# Altium project STM32_Project.PrjPcb
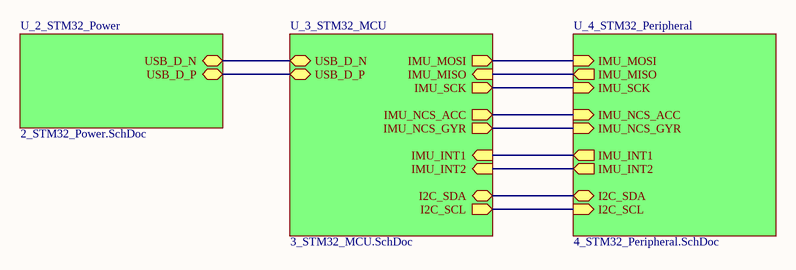
[diagram p0: 1_STM32_Overview.SchDoc]
4 sheets, 30 parts. Net scope: hierarchical (ports join the sheet entries above them; power ports are global).
Board file: STM32_PCB.PcbDoc
Sheets:
  1_STM32_Overview.SchDoc
    U_2_STM32_Power = 2_STM32_Power.SchDoc
    U_3_STM32_MCU = 3_STM32_MCU.SchDoc
    U_4_STM32_Peripheral = 4_STM32_Peripheral.SchDoc

## Sheet 1_STM32_Overview.SchDoc
size A; SheetNumber: 1; SheetTotal: 4

### Sub-sheets
U_2_STM32_Power = 2_STM32_Power.SchDoc: USB_D_N (bidir), USB_D_P (bidir)
U_3_STM32_MCU = 3_STM32_MCU.SchDoc: USB_D_N (bidir), USB_D_P (bidir), IMU_NCS_ACC (out), IMU_NCS_GYR (out), IMU_SCK (out), IMU_MISO (in), IMU_MOSI (out), I2C_SCL (out), I2C_SDA (bidir), IMU_INT1 (in), IMU_INT2 (in)
U_4_STM32_Peripheral = 4_STM32_Peripheral.SchDoc: IMU_SCK (in), IMU_MOSI (in), IMU_MISO (out), IMU_NCS_ACC (in), IMU_NCS_GYR (in), IMU_INT1 (out), IMU_INT2 (out), I2C_SCL (in), I2C_SDA (bidir)

### Nets
I2C_SCL: sheet U_3_STM32_MCU/I2C_SCL, sheet U_4_STM32_Peripheral/I2C_SCL
I2C_SDA: sheet U_3_STM32_MCU/I2C_SDA, sheet U_4_STM32_Peripheral/I2C_SDA
IMU_INT1: sheet U_3_STM32_MCU/IMU_INT1, sheet U_4_STM32_Peripheral/IMU_INT1
IMU_INT2: sheet U_3_STM32_MCU/IMU_INT2, sheet U_4_STM32_Peripheral/IMU_INT2
IMU_MISO: sheet U_3_STM32_MCU/IMU_MISO, sheet U_4_STM32_Peripheral/IMU_MISO
IMU_MOSI: sheet U_3_STM32_MCU/IMU_MOSI, sheet U_4_STM32_Peripheral/IMU_MOSI
IMU_NCC_ACC: sheet U_3_STM32_MCU/IMU_NCS_ACC, sheet U_4_STM32_Peripheral/IMU_NCS_ACC
IMU_NCC_GYR: sheet U_3_STM32_MCU/IMU_NCS_GYR, sheet U_4_STM32_Peripheral/IMU_NCS_GYR
IMU_SCK: sheet U_3_STM32_MCU/IMU_SCK, sheet U_4_STM32_Peripheral/IMU_SCK
USB_D_N: sheet U_2_STM32_Power/USB_D_N, sheet U_3_STM32_MCU/USB_D_N
USB_D_P: sheet U_2_STM32_Power/USB_D_P, sheet U_3_STM32_MCU/USB_D_P

## Sheet 2_STM32_Power.SchDoc
size A; SheetNumber: 2; SheetTotal: 4
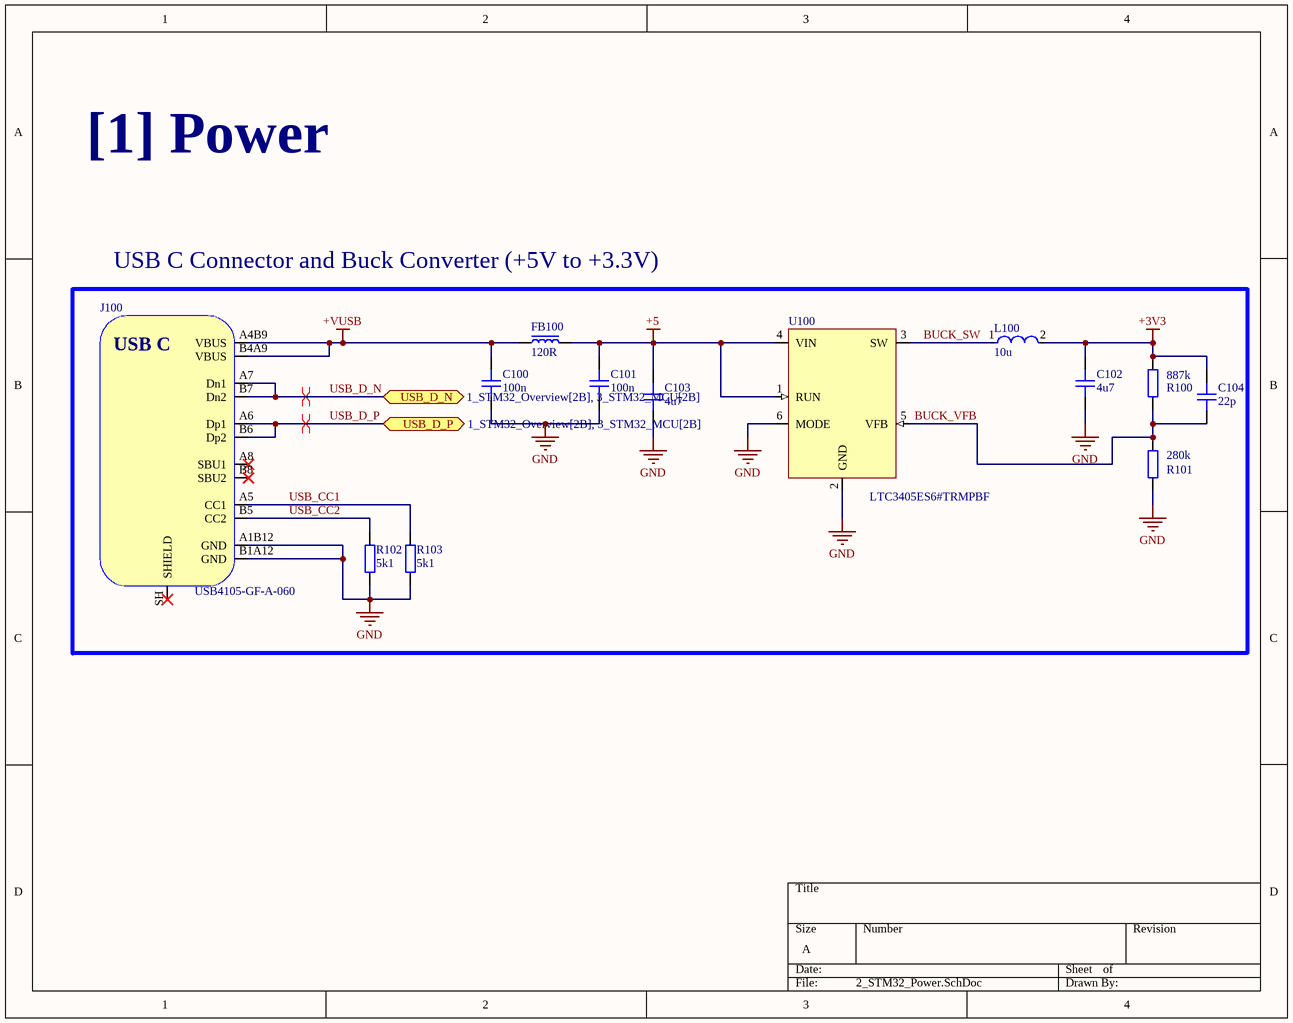
[diagram p1: 2_STM32_Power.SchDoc]

### Parts
C100  100n  [CAP_0603]
C101  100n  [CAP_0603]
C102  4u7  [CAP_0603]
C103  4u7  [CAP_0603]
C104  22p  [CAP_0603]
FB100  120R  [FB_0603]
J100  USB4105-GF-A-060  [USB4105-GF-A-060]
L100  10u  [FP-NRH2412-MFG]
R100  887k  [RES_0603]
R101  280k  [RES_0603]
R102  5k1  [RES_0603]
R103  5k1  [RES_0603]
U100  LTC3405ES6#TRMPBF  [SOT-23-6]

### Blocks framed on the sheet
USB C Connector and Buck Converter (+5V to +3.3V): C100-C104 FB100 J100 L100 R100-R103 U100

### Ports
USB_D_N (bidir, see 1_STM32_Overview[2B], 3_STM32_MCU[2B]), USB_D_P (bidir, see 1_STM32_Overview[2B], 3_STM32_MCU[2B])

### Nets
+3V3: C102.2 C104.2 L100.2 R100.2
+5: C101.2 C103.2 FB100.2 U100.1(RUN) U100.4(VIN)
+VUSB: C100.2 FB100.1 J100.A4B9(VBUS) J100.B4A9(VBUS)
GND: C100.1 C101.1 C102.1 C103.1 J100.A1B12(GND) J100.B1A12(GND) R101.1 R102.1 R103.1 U100.2(GND) U100.6(MODE)
BUCK_SW: L100.1 U100.3(SW)
BUCK_VFB: C104.1 R100.1 R101.2 U100.5(VFB)
USB_CC1: J100.A5(CC1) R103.2
USB_CC2: J100.B5(CC2) R102.2
USB_D_N: J100.A7(Dn1) J100.B7(Dn2) ; port USB_D_N
USB_D_P: J100.A6(Dp1) J100.B6(Dp2) ; port USB_D_P

Not connected (* = marked no-connect by the designer): J100 A8(SBU1)* B8(SBU2)* SH(SHIELD)*

### Layout directives
differential pair; differential pair class USB: USB_D_N, USB_D_P

### Notes on the sheet
- [1] Power
- (in symbol USB4105-GF-A-060) USB C

### Library data of the parts
C100-C104 = CAP_0603: Capacitor SMD 0603; Manufacturer: *; Manufacturer Part Number: *; Distributor Link: *; LCSC: *; Rating: *; Dielectric: *
FB100 = FB_0603: Ferrite Bead SMD 0603; Manufacturer: *; Manufacturer Part Number: *; Distributor Link: *; LCSC: *
J100 = USB4105-GF-A-060: USB Connector Type C SMT 12 Pin; Manufacturer: GCT; Manufacturer Part Number: USB4105-GF-A-060; Distributor Link: https://eu.mouser.com/ProductDetail/GCT/USB4105-GF-A-060?qs=QNEnbhJQKvY2mocwNJzgfA%3D%3D
L100 = CMP-14484-000582-1: Shielded Wirewound Inductor 10uH 20% 0.51A 0.72Ω SMD; DC Resistance (DCR): 600mR; Current Rating: 450mA; Saturation Current: 810mA; Core Material: Ferrite; Test Frequency: 100kHz; Self Resonant Frequency: 29MHz; Termination: SMD/SMT; Shielding: Shielded; Height - Seated (Max): 0.047inch; Case/Package: Nonstandard; Tolerance: 20%; Height: 1.2mm; Package Quantity: 2500; Mount: Surface Mount; Min Operating Temperature: -25°C; Inductance: 10uH; Width: 0.095inch; Length: 0.095inch; RoHS Compliant: Yes; Max DC Current: 810mA; Packaging: Tape and Reel; Max Operating Temperature: 120°C; Halogen Free: Halogen Free
R100 R101 = CMP-009-00183-1: Resistor SMD 0603; Manufacturer Part Number: *; Distributor Link: *; LCSC: *; Source: Schematic-Lib-PhilsLab.SchLib; Manufacturer: *; Design Item ID: RES_0603
R102 R103 = RES_0603: Resistor SMD 0603; Manufacturer: *; Manufacturer Part Number: *; Distributor Link: *; LCSC: *
U100 = LTC3405ES6#TRMPBF: 1.5MHz, 300mA / Synchronous Step-Down / Regulator in ThinSOT; Manufacturer: Analog Devices; Manufacturer Part Number: LTC3405ES6#TRMPBF

## Sheet 3_STM32_MCU.SchDoc
size A; SheetNumber: 3; SheetTotal: 4
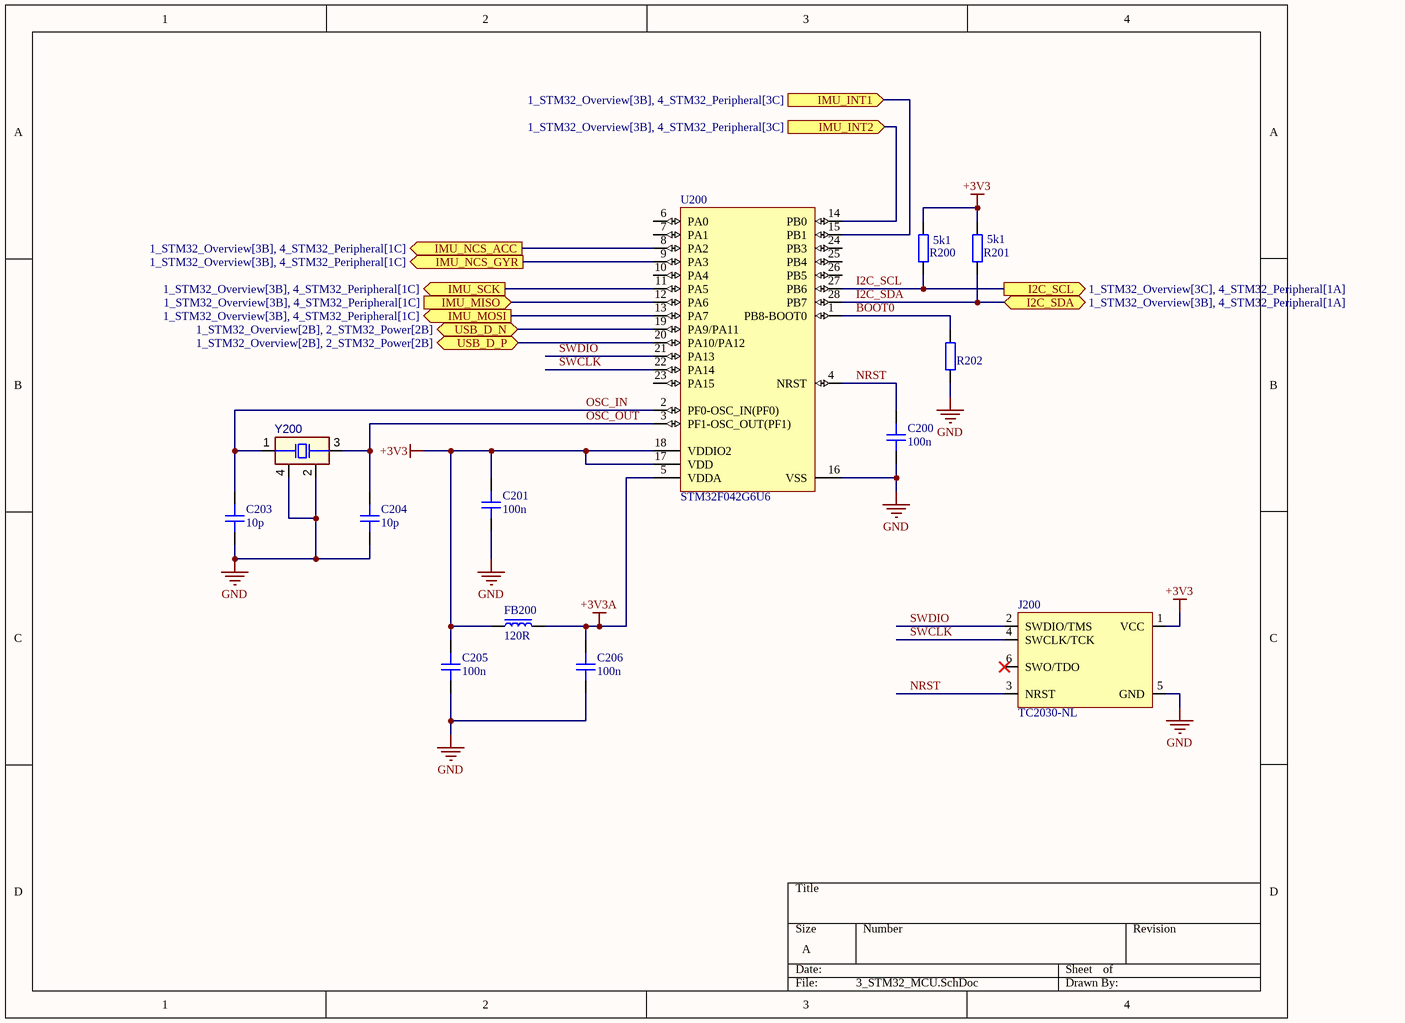
[diagram p2: 3_STM32_MCU.SchDoc]

### Parts
C200  100n  [CAP_0603]
C201  100n  [CAP_0603]
C203  10p  [CAP_0603]
C204  10p  [CAP_0603]
C205  100n  [CAP_0603]
C206  100n  [CAP_0603]
FB200  120R  [FB_0603]
J200  TC2030-NL  [TC2030-NL-FP]  (no BOM)
R200  5k1  [RES_0603]
R201  5k1  [RES_0603]
R202  5k1  [RES_0603]  (value not drawn)
U200  STM32F042G6U6  [STM-UFQFPN28_V]
Y200  FA-12824.0000MF10Z-W3  [EPSON-FA-128_V]  (value not drawn)

### Ports
I2C_SCL (out, see 1_STM32_Overview[3C], 4_STM32_Peripheral[1A]), I2C_SDA (bidir, see 1_STM32_Overview[3B], 4_STM32_Peripheral[1A]), IMU_INT1 (in, see 1_STM32_Overview[3B], 4_STM32_Peripheral[3C]), IMU_INT2 (in, see 1_STM32_Overview[3B], 4_STM32_Peripheral[3C]), IMU_MISO (in, see 1_STM32_Overview[3B], 4_STM32_Peripheral[1C]), IMU_MOSI (out, see 1_STM32_Overview[3B], 4_STM32_Peripheral[1C]), IMU_NCS_ACC (out, see 1_STM32_Overview[3B], 4_STM32_Peripheral[1C]), IMU_NCS_GYR (out, see 1_STM32_Overview[3B], 4_STM32_Peripheral[1C]), IMU_SCK (out, see 1_STM32_Overview[3B], 4_STM32_Peripheral[1C]), USB_D_N (bidir, see 1_STM32_Overview[2B], 2_STM32_Power[2B]), USB_D_P (bidir, see 1_STM32_Overview[2B], 2_STM32_Power[2B])

### Nets
+3V3: C201.2 C205.2 FB200.1 J200.1(VCC) R200.2 R201.2 U200.17(VDD) U200.18(VDDIO2)
+3V3A: C206.2 FB200.2 U200.5(VDDA)
GND: C200.1 C201.1 C203.1 C204.1 C205.1 C206.1 J200.5(GND) R202.2 U200.16(VSS) Y200.2(NC) Y200.4(NC)
BOOT0: R202.1 U200.1(PB8-BOOT0)
I2C_SCL: R200.1 U200.27(PB6) ; port I2C_SCL
I2C_SDA: R201.1 U200.28(PB7) ; port I2C_SDA
IMU_INT1: U200.15(PB1) ; port IMU_INT1
IMU_INT2: U200.14(PB0) ; port IMU_INT2
IMU_MISO: U200.12(PA6) ; port IMU_MISO
IMU_MOSI: U200.13(PA7) ; port IMU_MOSI
IMU_NCC_ACC: U200.8(PA2) ; port IMU_NCS_ACC
IMU_NCC_GYR: U200.9(PA3) ; port IMU_NCS_GYR
IMU_SCK: U200.11(PA5) ; port IMU_SCK
NRST: C200.2 J200.3(NRST) U200.4(NRST)
OSC_IN: C203.2 U200.2(PF0-OSC_IN(PF0)) Y200.1(X1)
OSC_OUT: C204.2 U200.3(PF1-OSC_OUT(PF1)) Y200.3(X2)
SWCLK: J200.4(SWCLK/TCK) U200.22(PA14)
SWDIO: J200.2(SWDIO/TMS) U200.21(PA13)
USB_D_N: U200.19(PA9/PA11) ; port USB_D_N
USB_D_P: U200.20(PA10/PA12) ; port USB_D_P

Not connected (* = marked no-connect by the designer): J200 6(SWO/TDO)*; U200 6(PA0) 7(PA1) 10(PA4) 23(PA15) 24(PB3) 25(PB4) 26(PB5)

### Library data of the parts
C200 C201 C205 C206 = CAP_0603: Capacitor SMD 0603; Manufacturer: *; Manufacturer Part Number: *; Distributor Link: *; LCSC: *; Rating: *; Dielectric: *
C203 C204 = CMP-001-00087-1: Capacitor SMD 0603; Manufacturer Part Number: *; Distributor Link: *; Manufacturer: *; Rating: *; Design Item ID: CAP_0603; Source: Schematic-Lib-PhilsLab.SchLib; Dielectric: *; LCSC: *
FB200 = FB_0603: Ferrite Bead SMD 0603; Manufacturer: *; Manufacturer Part Number: *; Distributor Link: *; LCSC: *
J200 = CMP-002-00087-1: Tag-Connect No-Solder SWD Debug Connector (No Legs) DO NOT PLACE; Manufacturer: Tag-Connect; Design Item ID: TC2030-NL; Manufacturer Part Number: TC2030-NL-FP; Source: Schematic-Lib-PhilsLab.SchLib
R200-R202 = CMP-009-00183-1: Resistor SMD 0603; Manufacturer Part Number: *; Distributor Link: *; LCSC: *; Source: Schematic-Lib-PhilsLab.SchLib; Manufacturer: *; Design Item ID: RES_0603
U200 = CMP-0304-00112-2: ARM Cortex-M0 32-bit MCU, 32 KB Flash, 6 KB Internal RAM, 24 I/Os, 28-Pin UFQFPN, -40 to 85 degC, Tray; Manufacturer: STMicroelectronics; FLASH Size (Prog) (kB): 32; I/Os (High Current): 24; Internal RAM Size (kB): 6; Supply Voltage(Vcc) min (V): 2; Operating Frequency(F) (Processor speed) (MHz): 48; Core: ARM Cortex-M0; PartNumber: STM32F042G6U6; Packing: Tray; Package Description: 28-Pin Ultra Thin Fine Pitch Quad Flat No-Lead, 4 x 4 x 0.6 mm Body, 0.5 mm Pitch; ComponentLink2Description: Datasheet; ComponentLink1Description: Manufacturer URL; Package Reference: UFQFPN28; DatasheetVersion: Rev. 5; ComponentLink1URL: http://www.st.com/; ComponentLink2URL: http://www.st.com/st-web-ui/static/active/en/resource/technical/document/datasheet/DM00105814.pdf; Mounting Technology: Surface Mount
Y200 = CMP-003-00028-1: Crystal, 24 MHz, +/- 10 ppm, -20 to 75 degC, 4-Pin SMD, RoHS, Tape and Reel; Load Capacitance: 12pF; Frequency: 24MHz; ESR: 80; Mounting Technology: SMT; Pins: 4; Case/Package: SMD/SMT; Min Operating Temperature: -20°C; RoHS Compliant: Yes; Max Operating Temperature: 75°C

## Sheet 4_STM32_Peripheral.SchDoc
size A; SheetNumber: 4; SheetTotal: 4
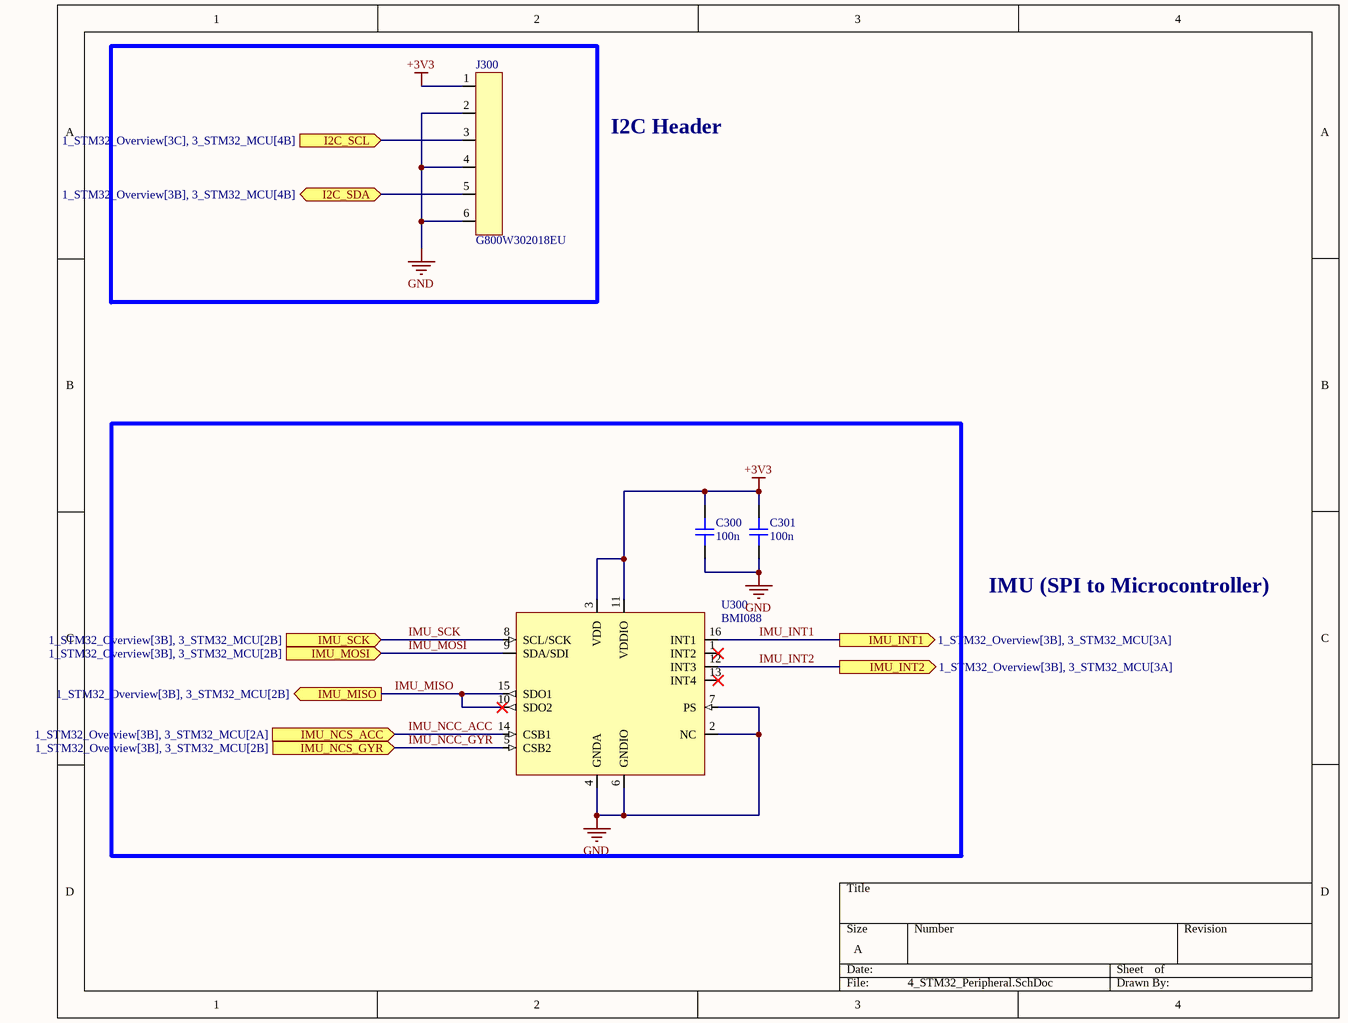
[diagram p3: 4_STM32_Peripheral.SchDoc]

### Parts
C300  100n  [CAP_0603]
C301  100n  [CAP_0603]
J300  G800W302018EU  [G800W302018EU]
U300  BMI088  [BMI088]

### Ports
I2C_SCL (in, see 1_STM32_Overview[3C], 3_STM32_MCU[4B]), I2C_SDA (bidir, see 1_STM32_Overview[3B], 3_STM32_MCU[4B]), IMU_INT1 (out, see 1_STM32_Overview[3B], 3_STM32_MCU[3A]), IMU_INT2 (out, see 1_STM32_Overview[3B], 3_STM32_MCU[3A]), IMU_MISO (out, see 1_STM32_Overview[3B], 3_STM32_MCU[2B]), IMU_MOSI (in, see 1_STM32_Overview[3B], 3_STM32_MCU[2B]), IMU_NCS_ACC (in, see 1_STM32_Overview[3B], 3_STM32_MCU[2A]), IMU_NCS_GYR (in, see 1_STM32_Overview[3B], 3_STM32_MCU[2B]), IMU_SCK (in, see 1_STM32_Overview[3B], 3_STM32_MCU[2B])

### Nets
+3V3: C300.2 C301.2 J300.1 U300.3(VDD) U300.11(VDDIO)
GND: C300.1 C301.1 J300.2 J300.4 J300.6 U300.2(NC) U300.4(GNDA) U300.6(GNDIO) U300.7(PS)
I2C_SCL: J300.3 ; port I2C_SCL
I2C_SDA: J300.5 ; port I2C_SDA
IMU_INT1: U300.16(INT1) ; port IMU_INT1
IMU_INT2: U300.12(INT3) ; port IMU_INT2
IMU_MISO: U300.10(SDO2) U300.15(SDO1) ; port IMU_MISO
IMU_MOSI: U300.9(SDA/SDI) ; port IMU_MOSI
IMU_NCC_ACC: U300.14(CSB1) ; port IMU_NCS_ACC
IMU_NCC_GYR: U300.5(CSB2) ; port IMU_NCS_GYR
IMU_SCK: U300.8(SCL/SCK) ; port IMU_SCK

Not connected (* = marked no-connect by the designer): U300 1(INT2)* 13(INT4)*

### Notes on the sheet
- I2C Header
- IMU (SPI to Microcontroller)

### Library data of the parts
C300 C301 = CMP-001-00087-1: Capacitor SMD 0603; Manufacturer Part Number: *; Distributor Link: *; Manufacturer: *; Rating: *; Design Item ID: CAP_0603; Source: Schematic-Lib-PhilsLab.SchLib; Dielectric: *; LCSC: *
J300 = CMP-002-00116-1: Pin Header 6 Position 2.54mm Pitch; Manufacturer: Amphenol; Design Item ID: G800W302018EU; Manufacturer Part Number: G800W302018EU; Source: Schematic-Lib-PhilsLab.SchLib
U300 = CMP-028-000011-1: Inertial Measurement Unit IMU 6-Axis LGA; Manufacturer: Bosch; Manufacturer Part Number: BMI088; Source: Schematic-Lib-PhilsLab.SchLib; Design Item ID: BMI088

## Nets that join several sheets
+3V3: 2_STM32_Power (C102.2 C104.2 L100.2 R100.2), 3_STM32_MCU (8 pins), 4_STM32_Peripheral (5 pins)
GND: 2_STM32_Power (11 pins), 3_STM32_MCU (11 pins), 4_STM32_Peripheral (9 pins)
I2C_SCL: 3_STM32_MCU (R200.1 U200.27), 4_STM32_Peripheral (J300.3)
I2C_SDA: 3_STM32_MCU (R201.1 U200.28), 4_STM32_Peripheral (J300.5)
IMU_INT1: 3_STM32_MCU (U200.15), 4_STM32_Peripheral (U300.16)
IMU_INT2: 3_STM32_MCU (U200.14), 4_STM32_Peripheral (U300.12)
IMU_MISO: 3_STM32_MCU (U200.12), 4_STM32_Peripheral (U300.10 U300.15)
IMU_MOSI: 3_STM32_MCU (U200.13), 4_STM32_Peripheral (U300.9)
IMU_NCC_ACC: 3_STM32_MCU (U200.8), 4_STM32_Peripheral (U300.14)
IMU_NCC_GYR: 3_STM32_MCU (U200.9), 4_STM32_Peripheral (U300.5)
IMU_SCK: 3_STM32_MCU (U200.11), 4_STM32_Peripheral (U300.8)
USB_D_N: 2_STM32_Power (J100.A7 J100.B7), 3_STM32_MCU (U200.19)
USB_D_P: 2_STM32_Power (J100.A6 J100.B6), 3_STM32_MCU (U200.20)